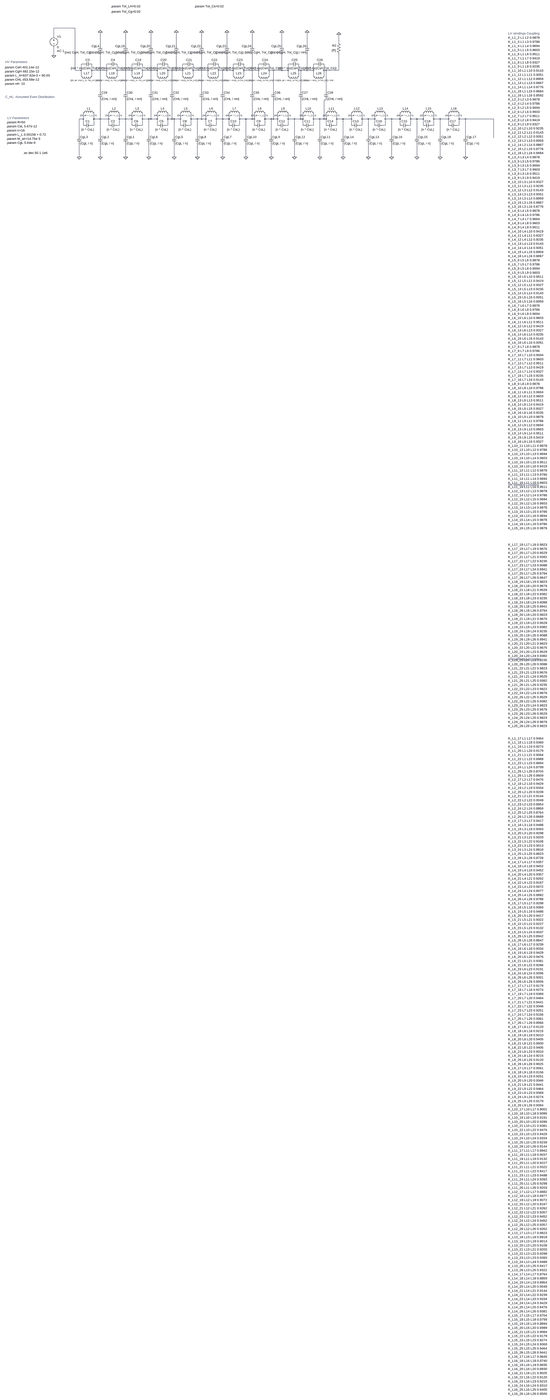
[diagram p0: schematic lumped_network_Coupling_HV.asc, whole sheet]
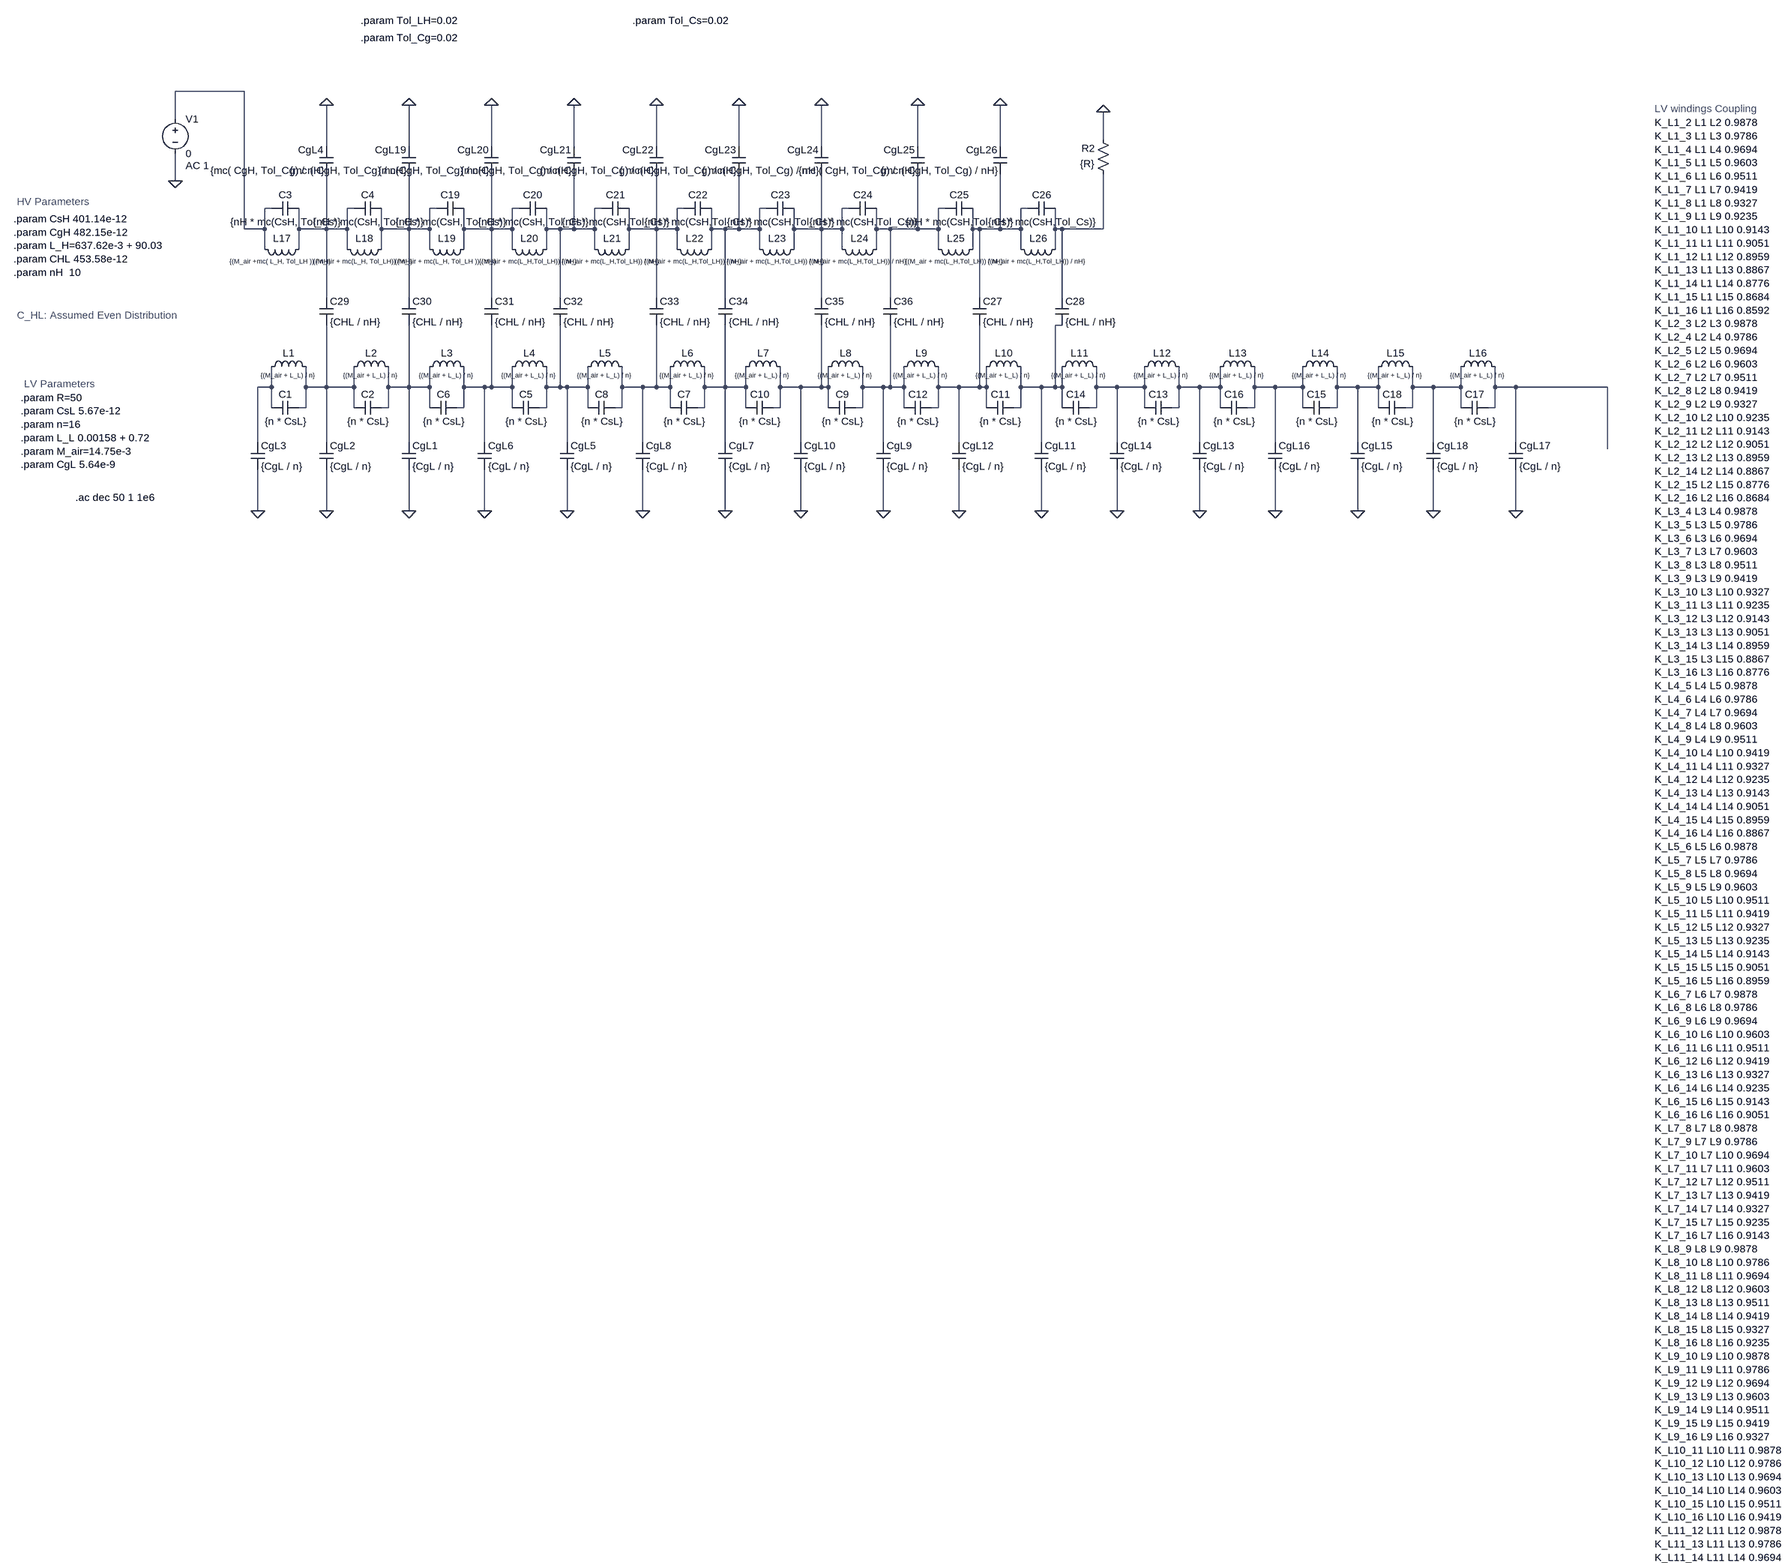
[diagram p1: schematic lumped_network_Coupling_HV.asc, part, row 1 of 3, column 1 of 1]
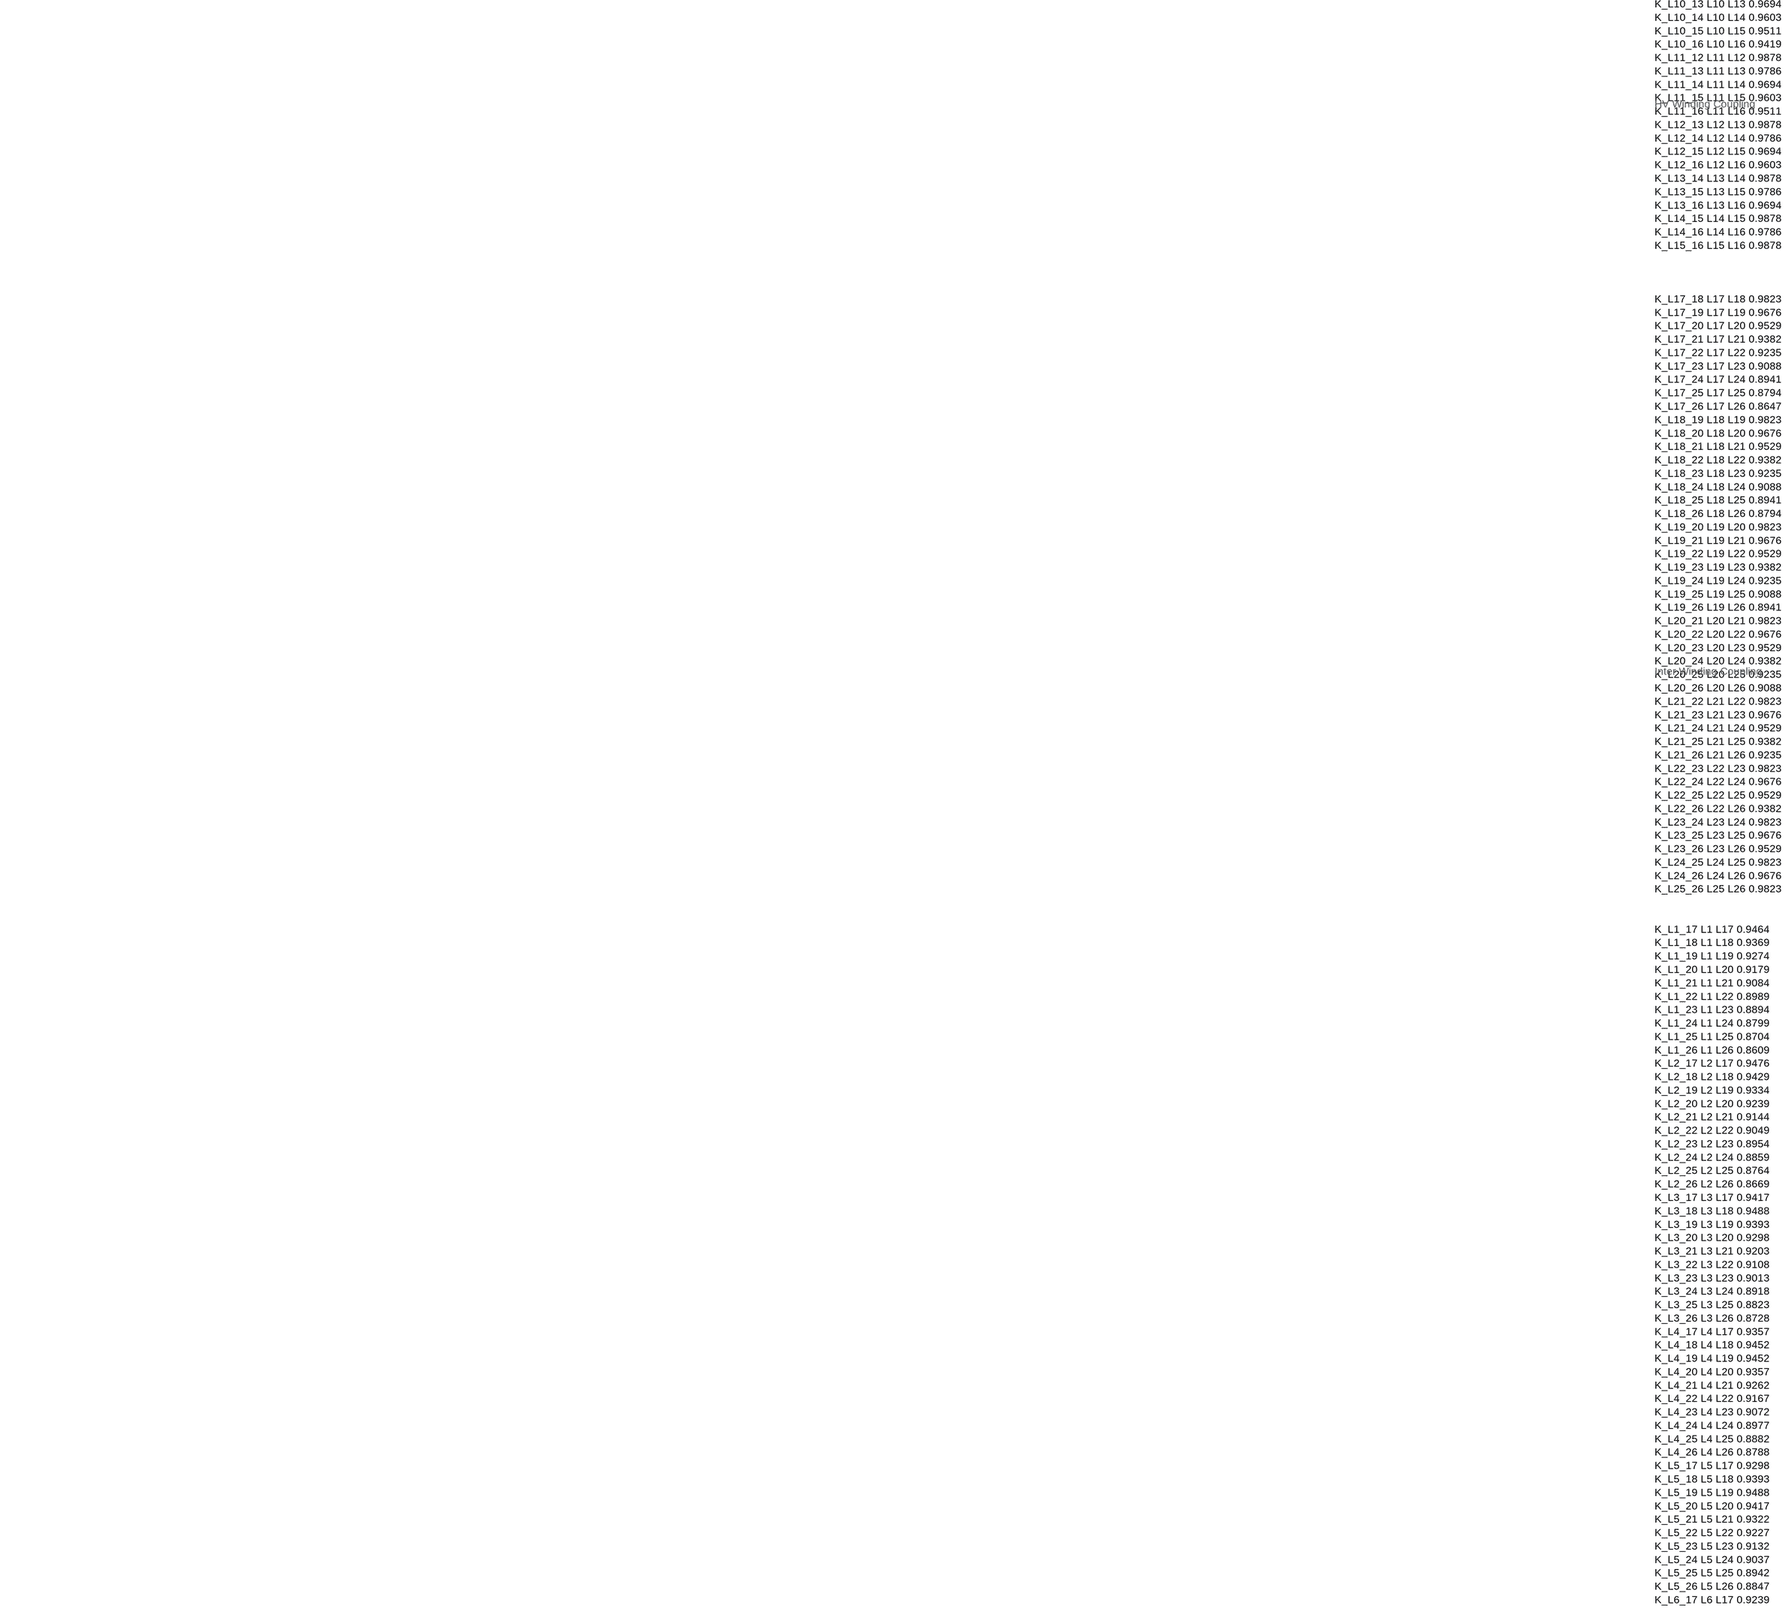
[diagram p2: schematic lumped_network_Coupling_HV.asc, part, row 2 of 3, column 1 of 1]
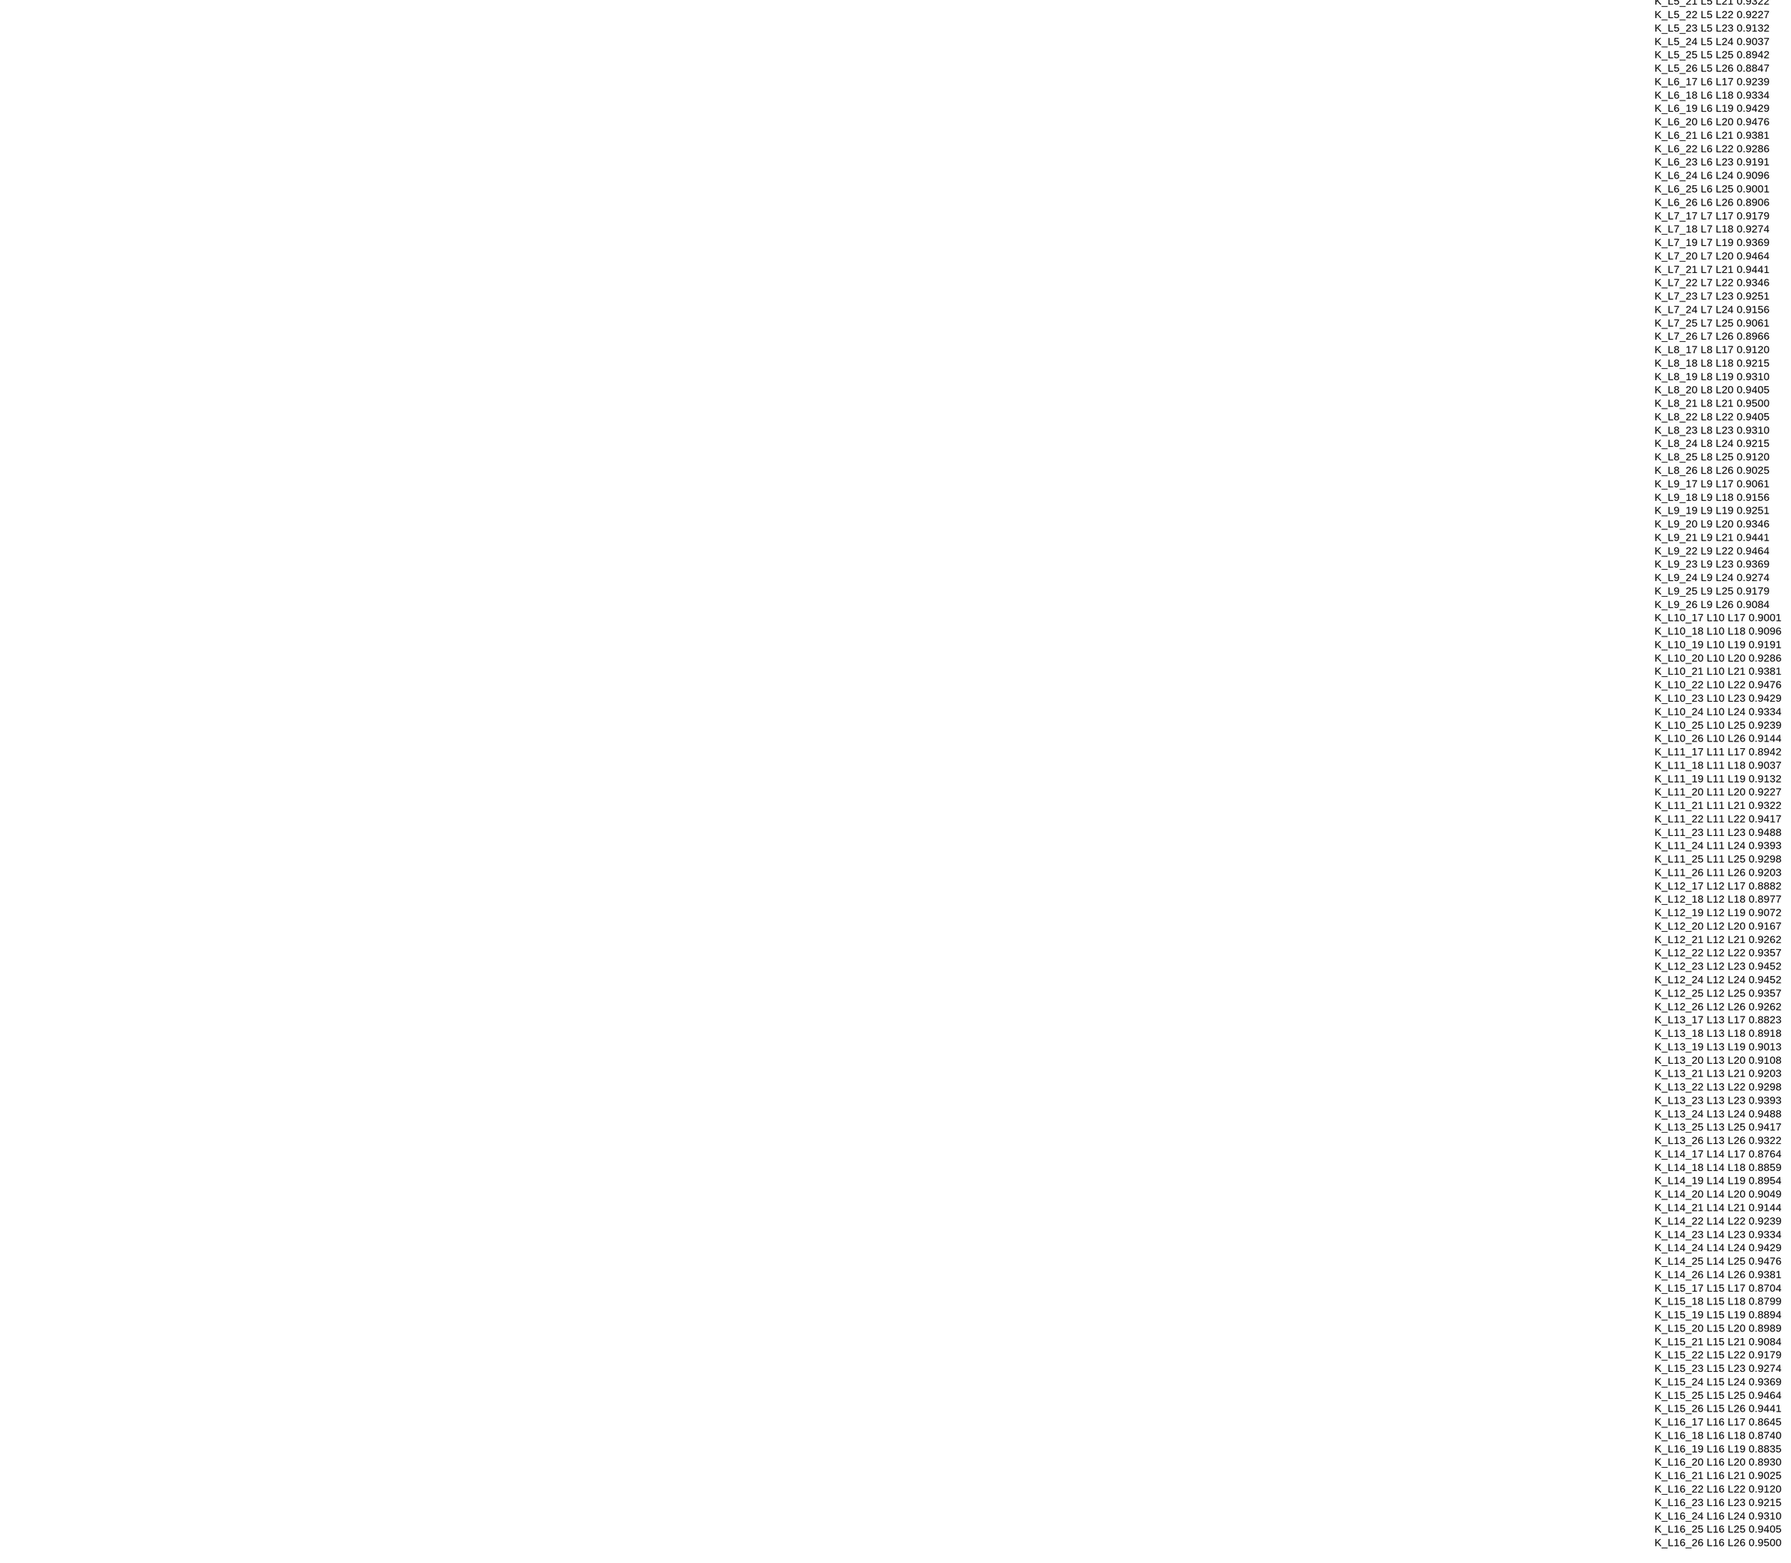
[diagram p3: schematic lumped_network_Coupling_HV.asc, part, row 3 of 3, column 1 of 1]
lumped_network_Coupling_HV.asc, the LTspice schematic file:
Version 4.1
SHEET 1 4352 8728
WIRE 432 -544 272 -544
WIRE 272 -480 272 -544
WIRE 2432 -432 2432 -496
WIRE 624 -416 624 -512
WIRE 816 -416 816 -512
WIRE 1008 -416 1008 -512
WIRE 1200 -416 1200 -512
WIRE 1392 -416 1392 -512
WIRE 1584 -416 1584 -512
WIRE 1776 -416 1776 -512
WIRE 2000 -416 2000 -512
WIRE 2192 -416 2192 -512
WIRE 272 -336 272 -400
WIRE 496 -272 480 -272
WIRE 688 -272 672 -272
WIRE 880 -272 864 -272
WIRE 1072 -272 1056 -272
WIRE 1264 -272 1248 -272
WIRE 1456 -272 1440 -272
WIRE 1648 -272 1632 -272
WIRE 1840 -272 1824 -272
WIRE 2064 -272 2048 -272
WIRE 2256 -272 2240 -272
WIRE 432 -224 432 -544
WIRE 480 -224 480 -272
WIRE 480 -224 432 -224
WIRE 560 -224 560 -272
WIRE 624 -224 624 -352
WIRE 624 -224 560 -224
WIRE 672 -224 672 -272
WIRE 672 -224 624 -224
WIRE 752 -224 752 -272
WIRE 816 -224 816 -352
WIRE 816 -224 752 -224
WIRE 864 -224 864 -272
WIRE 864 -224 816 -224
WIRE 944 -224 944 -272
WIRE 1008 -224 1008 -352
WIRE 1008 -224 944 -224
WIRE 1056 -224 1056 -272
WIRE 1056 -224 1008 -224
WIRE 1136 -224 1136 -272
WIRE 1168 -224 1136 -224
WIRE 1200 -224 1200 -352
WIRE 1200 -224 1168 -224
WIRE 1248 -224 1248 -272
WIRE 1248 -224 1200 -224
WIRE 1328 -224 1328 -272
WIRE 1392 -224 1392 -352
WIRE 1392 -224 1328 -224
WIRE 1440 -224 1440 -272
WIRE 1440 -224 1392 -224
WIRE 1520 -224 1520 -272
WIRE 1552 -224 1520 -224
WIRE 1584 -224 1584 -352
WIRE 1584 -224 1552 -224
WIRE 1632 -224 1632 -272
WIRE 1632 -224 1584 -224
WIRE 1712 -224 1712 -272
WIRE 1776 -224 1776 -352
WIRE 1776 -224 1712 -224
WIRE 1824 -224 1824 -272
WIRE 1824 -224 1776 -224
WIRE 1904 -224 1904 -272
WIRE 1936 -224 1904 -224
WIRE 2000 -224 2000 -352
WIRE 2000 -224 1936 -224
WIRE 2048 -224 2048 -272
WIRE 2048 -224 2000 -224
WIRE 2128 -224 2128 -272
WIRE 2144 -224 2128 -224
WIRE 2192 -224 2192 -352
WIRE 2192 -224 2144 -224
WIRE 2240 -224 2240 -272
WIRE 2240 -224 2192 -224
WIRE 2320 -224 2320 -272
WIRE 2336 -224 2320 -224
WIRE 2432 -224 2432 -352
WIRE 2432 -224 2336 -224
WIRE 480 -176 480 -224
WIRE 560 -176 560 -224
WIRE 672 -176 672 -224
WIRE 752 -176 752 -224
WIRE 864 -176 864 -224
WIRE 944 -176 944 -224
WIRE 1056 -176 1056 -224
WIRE 1136 -176 1136 -224
WIRE 1248 -176 1248 -224
WIRE 1328 -176 1328 -224
WIRE 1440 -176 1440 -224
WIRE 1520 -176 1520 -224
WIRE 1632 -176 1632 -224
WIRE 1712 -176 1712 -224
WIRE 1824 -176 1824 -224
WIRE 1904 -176 1904 -224
WIRE 2048 -176 2048 -224
WIRE 2128 -176 2128 -224
WIRE 2240 -176 2240 -224
WIRE 2320 -176 2320 -224
WIRE 624 -64 624 -224
WIRE 816 -64 816 -224
WIRE 1008 -64 1008 -224
WIRE 1168 -64 1168 -224
WIRE 1392 -64 1392 -224
WIRE 1552 -64 1552 -224
WIRE 1776 -64 1776 -224
WIRE 1936 -64 1936 -224
WIRE 2144 -64 2144 -224
WIRE 2336 -64 2336 -224
WIRE 2336 0 2320 0
WIRE 496 144 496 96
WIRE 496 144 464 144
WIRE 576 144 576 96
WIRE 624 144 624 0
WIRE 624 144 576 144
WIRE 688 144 688 96
WIRE 688 144 624 144
WIRE 768 144 768 96
WIRE 816 144 816 0
WIRE 816 144 768 144
WIRE 864 144 864 96
WIRE 864 144 816 144
WIRE 944 144 944 96
WIRE 992 144 944 144
WIRE 1008 144 1008 0
WIRE 1008 144 992 144
WIRE 1056 144 1056 96
WIRE 1056 144 1008 144
WIRE 1136 144 1136 96
WIRE 1168 144 1168 0
WIRE 1168 144 1136 144
WIRE 1184 144 1168 144
WIRE 1232 144 1232 96
WIRE 1232 144 1184 144
WIRE 1312 144 1312 96
WIRE 1360 144 1312 144
WIRE 1392 144 1392 0
WIRE 1392 144 1360 144
WIRE 1424 144 1424 96
WIRE 1424 144 1392 144
WIRE 1504 144 1504 96
WIRE 1552 144 1552 0
WIRE 1552 144 1504 144
WIRE 1600 144 1600 96
WIRE 1600 144 1552 144
WIRE 1680 144 1680 96
WIRE 1728 144 1680 144
WIRE 1776 144 1776 0
WIRE 1776 144 1728 144
WIRE 1792 144 1792 96
WIRE 1792 144 1776 144
WIRE 1872 144 1872 96
WIRE 1920 144 1872 144
WIRE 1936 144 1936 0
WIRE 1936 144 1920 144
WIRE 1968 144 1968 96
WIRE 1968 144 1936 144
WIRE 2048 144 2048 96
WIRE 2096 144 2048 144
WIRE 2144 144 2144 0
WIRE 2144 144 2096 144
WIRE 2160 144 2160 96
WIRE 2160 144 2144 144
WIRE 2240 144 2240 96
WIRE 2288 144 2240 144
WIRE 2320 144 2320 0
WIRE 2320 144 2288 144
WIRE 2336 144 2336 96
WIRE 2336 144 2320 144
WIRE 2416 144 2416 96
WIRE 2464 144 2416 144
WIRE 2528 144 2528 96
WIRE 2528 144 2464 144
WIRE 2608 144 2608 96
WIRE 2656 144 2608 144
WIRE 2704 144 2704 96
WIRE 2704 144 2656 144
WIRE 2784 144 2784 96
WIRE 2832 144 2784 144
WIRE 2896 144 2896 96
WIRE 2896 144 2832 144
WIRE 2976 144 2976 96
WIRE 3024 144 2976 144
WIRE 3072 144 3072 96
WIRE 3072 144 3024 144
WIRE 3152 144 3152 96
WIRE 3200 144 3152 144
WIRE 3264 144 3264 96
WIRE 3264 144 3200 144
WIRE 3344 144 3344 96
WIRE 3392 144 3344 144
WIRE 3616 144 3392 144
WIRE 496 192 496 144
WIRE 576 192 576 144
WIRE 576 192 560 192
WIRE 688 192 688 144
WIRE 768 192 768 144
WIRE 768 192 752 192
WIRE 864 192 864 144
WIRE 944 192 944 144
WIRE 944 192 928 192
WIRE 1056 192 1056 144
WIRE 1136 192 1136 144
WIRE 1136 192 1120 192
WIRE 1232 192 1232 144
WIRE 1312 192 1312 144
WIRE 1312 192 1296 192
WIRE 1424 192 1424 144
WIRE 1504 192 1504 144
WIRE 1504 192 1488 192
WIRE 1600 192 1600 144
WIRE 1680 192 1680 144
WIRE 1680 192 1664 192
WIRE 1792 192 1792 144
WIRE 1872 192 1872 144
WIRE 1872 192 1856 192
WIRE 1968 192 1968 144
WIRE 2048 192 2048 144
WIRE 2048 192 2032 192
WIRE 2160 192 2160 144
WIRE 2240 192 2240 144
WIRE 2240 192 2224 192
WIRE 2336 192 2336 144
WIRE 2416 192 2416 144
WIRE 2416 192 2400 192
WIRE 2528 192 2528 144
WIRE 2608 192 2608 144
WIRE 2608 192 2592 192
WIRE 2704 192 2704 144
WIRE 2784 192 2784 144
WIRE 2784 192 2768 192
WIRE 2896 192 2896 144
WIRE 2976 192 2976 144
WIRE 2976 192 2960 192
WIRE 3072 192 3072 144
WIRE 3152 192 3152 144
WIRE 3152 192 3136 192
WIRE 3264 192 3264 144
WIRE 3344 192 3344 144
WIRE 3344 192 3328 192
WIRE 464 272 464 144
WIRE 624 272 624 144
WIRE 816 272 816 144
WIRE 992 272 992 144
WIRE 1184 272 1184 144
WIRE 1360 272 1360 144
WIRE 1552 272 1552 144
WIRE 1728 272 1728 144
WIRE 1920 272 1920 144
WIRE 2096 272 2096 144
WIRE 2288 272 2288 144
WIRE 2464 272 2464 144
WIRE 2656 272 2656 144
WIRE 2832 272 2832 144
WIRE 3024 272 3024 144
WIRE 3200 272 3200 144
WIRE 3392 272 3392 144
WIRE 3616 288 3616 144
WIRE 464 432 464 336
WIRE 624 432 624 336
WIRE 816 432 816 336
WIRE 992 432 992 336
WIRE 1184 432 1184 336
WIRE 1360 432 1360 336
WIRE 1552 432 1552 336
WIRE 1728 432 1728 336
WIRE 1920 432 1920 336
WIRE 2096 432 2096 336
WIRE 2288 432 2288 336
WIRE 2464 432 2464 336
WIRE 2656 432 2656 336
WIRE 2832 432 2832 336
WIRE 3024 432 3024 336
WIRE 3200 432 3200 336
WIRE 3392 432 3392 336
FLAG 816 432 0
FLAG 272 -336 0
FLAG 624 432 0
FLAG 1184 432 0
FLAG 992 432 0
FLAG 1552 432 0
FLAG 1360 432 0
FLAG 1920 432 0
FLAG 1728 432 0
FLAG 2288 432 0
FLAG 2096 432 0
FLAG 2656 432 0
FLAG 2464 432 0
FLAG 3024 432 0
FLAG 2832 432 0
FLAG 3392 432 0
FLAG 3200 432 0
FLAG 2432 -496 0
FLAG 624 -512 0
FLAG 816 -512 0
FLAG 1008 -512 0
FLAG 1200 -512 0
FLAG 1392 -512 0
FLAG 1584 -512 0
FLAG 1776 -512 0
FLAG 2000 -512 0
FLAG 2192 -512 0
FLAG 464 432 0
DATAFLAG 560 -256 ""
SYMBOL voltage 272 -496 R0
WINDOW 123 24 124 Left 2
WINDOW 39 0 0 Left 0
SYMATTR Value2 AC 1
SYMATTR InstName V1
SYMATTR Value 0
SYMBOL cap 752 176 R90
WINDOW 0 0 32 VBottom 2
WINDOW 3 32 32 VTop 2
SYMATTR InstName C2
SYMATTR Value {n * CsL}
SYMBOL ind 672 112 R270
WINDOW 0 32 56 VTop 2
WINDOW 3 -14 56 VTop 1
SYMATTR InstName L2
SYMATTR Value {(M_air + L_L) / n}
SYMATTR Type ind
SYMBOL cap 800 272 R0
SYMATTR InstName CgL1
SYMATTR Value {CgL / n}
SYMBOL cap 560 176 R90
WINDOW 0 0 32 VBottom 2
WINDOW 3 32 32 VTop 2
SYMATTR InstName C1
SYMATTR Value {n * CsL}
SYMBOL ind 480 112 R270
WINDOW 0 32 56 VTop 2
WINDOW 3 -14 56 VTop 1
SYMATTR InstName L1
SYMATTR Value {(M_air + L_L) / n}
SYMATTR Type ind
SYMBOL cap 608 272 R0
SYMATTR InstName CgL2
SYMATTR Value {CgL / n}
SYMBOL cap 1120 176 R90
WINDOW 0 0 32 VBottom 2
WINDOW 3 32 32 VTop 2
SYMATTR InstName C5
SYMATTR Value {n * CsL}
SYMBOL ind 1040 112 R270
WINDOW 0 32 56 VTop 2
WINDOW 3 -14 56 VTop 1
SYMATTR InstName L4
SYMATTR Value {(M_air + L_L) / n}
SYMATTR Type ind
SYMBOL cap 1168 272 R0
SYMATTR InstName CgL5
SYMATTR Value {CgL / n}
SYMBOL cap 928 176 R90
WINDOW 0 0 32 VBottom 2
WINDOW 3 32 32 VTop 2
SYMATTR InstName C6
SYMATTR Value {n * CsL}
SYMBOL ind 848 112 R270
WINDOW 0 32 56 VTop 2
WINDOW 3 -14 56 VTop 1
SYMATTR InstName L3
SYMATTR Value {(M_air + L_L) / n}
SYMATTR Type ind
SYMBOL cap 976 272 R0
SYMATTR InstName CgL6
SYMATTR Value {CgL / n}
SYMBOL cap 1488 176 R90
WINDOW 0 0 32 VBottom 2
WINDOW 3 32 32 VTop 2
SYMATTR InstName C7
SYMATTR Value {n * CsL}
SYMBOL ind 1408 112 R270
WINDOW 0 32 56 VTop 2
WINDOW 3 -14 56 VTop 1
SYMATTR InstName L6
SYMATTR Value {(M_air + L_L) / n}
SYMATTR Type ind
SYMBOL cap 1536 272 R0
SYMATTR InstName CgL7
SYMATTR Value {CgL / n}
SYMBOL cap 1296 176 R90
WINDOW 0 0 32 VBottom 2
WINDOW 3 32 32 VTop 2
SYMATTR InstName C8
SYMATTR Value {n * CsL}
SYMBOL ind 1216 112 R270
WINDOW 0 32 56 VTop 2
WINDOW 3 -14 56 VTop 1
SYMATTR InstName L5
SYMATTR Value {(M_air + L_L) / n}
SYMATTR Type ind
SYMBOL cap 1344 272 R0
SYMATTR InstName CgL8
SYMATTR Value {CgL / n}
SYMBOL cap 1856 176 R90
WINDOW 0 0 32 VBottom 2
WINDOW 3 32 32 VTop 2
SYMATTR InstName C9
SYMATTR Value {n * CsL}
SYMBOL ind 1776 112 R270
WINDOW 0 32 56 VTop 2
WINDOW 3 -14 56 VTop 1
SYMATTR InstName L8
SYMATTR Value {(M_air + L_L) / n}
SYMATTR Type ind
SYMBOL cap 1904 272 R0
SYMATTR InstName CgL9
SYMATTR Value {CgL / n}
SYMBOL cap 1664 176 R90
WINDOW 0 0 32 VBottom 2
WINDOW 3 32 32 VTop 2
SYMATTR InstName C10
SYMATTR Value {n * CsL}
SYMBOL ind 1584 112 R270
WINDOW 0 32 56 VTop 2
WINDOW 3 -14 56 VTop 1
SYMATTR InstName L7
SYMATTR Value {(M_air + L_L) / n}
SYMATTR Type ind
SYMBOL cap 1712 272 R0
SYMATTR InstName CgL10
SYMATTR Value {CgL / n}
SYMBOL cap 2224 176 R90
WINDOW 0 0 32 VBottom 2
WINDOW 3 32 32 VTop 2
SYMATTR InstName C11
SYMATTR Value {n * CsL}
SYMBOL ind 2144 112 R270
WINDOW 0 32 56 VTop 2
WINDOW 3 -14 56 VTop 1
SYMATTR InstName L10
SYMATTR Value {(M_air + L_L) / n}
SYMATTR Type ind
SYMBOL cap 2272 272 R0
SYMATTR InstName CgL11
SYMATTR Value {CgL / n}
SYMBOL cap 2032 176 R90
WINDOW 0 0 32 VBottom 2
WINDOW 3 32 32 VTop 2
SYMATTR InstName C12
SYMATTR Value {n * CsL}
SYMBOL ind 1952 112 R270
WINDOW 0 32 56 VTop 2
WINDOW 3 -14 56 VTop 1
SYMATTR InstName L9
SYMATTR Value {(M_air + L_L) / n}
SYMATTR Type ind
SYMBOL cap 2080 272 R0
SYMATTR InstName CgL12
SYMATTR Value {CgL / n}
SYMBOL cap 2592 176 R90
WINDOW 0 0 32 VBottom 2
WINDOW 3 32 32 VTop 2
SYMATTR InstName C13
SYMATTR Value {n * CsL}
SYMBOL ind 2512 112 R270
WINDOW 0 32 56 VTop 2
WINDOW 3 -14 56 VTop 1
SYMATTR InstName L12
SYMATTR Value {(M_air + L_L) / n}
SYMATTR Type ind
SYMBOL cap 2640 272 R0
SYMATTR InstName CgL13
SYMATTR Value {CgL / n}
SYMBOL cap 2400 176 R90
WINDOW 0 0 32 VBottom 2
WINDOW 3 32 32 VTop 2
SYMATTR InstName C14
SYMATTR Value {n * CsL}
SYMBOL ind 2320 112 R270
WINDOW 0 32 56 VTop 2
WINDOW 3 -14 56 VTop 1
SYMATTR InstName L11
SYMATTR Value {(M_air + L_L) / n}
SYMATTR Type ind
SYMBOL cap 2448 272 R0
SYMATTR InstName CgL14
SYMATTR Value {CgL / n}
SYMBOL cap 2960 176 R90
WINDOW 0 0 32 VBottom 2
WINDOW 3 32 32 VTop 2
SYMATTR InstName C15
SYMATTR Value {n * CsL}
SYMBOL ind 2880 112 R270
WINDOW 0 32 56 VTop 2
WINDOW 3 -14 56 VTop 1
SYMATTR InstName L14
SYMATTR Value {(M_air + L_L) / n}
SYMATTR Type ind
SYMBOL cap 3008 272 R0
SYMATTR InstName CgL15
SYMATTR Value {CgL / n}
SYMBOL cap 2768 176 R90
WINDOW 0 0 32 VBottom 2
WINDOW 3 32 32 VTop 2
SYMATTR InstName C16
SYMATTR Value {n * CsL}
SYMBOL ind 2688 112 R270
WINDOW 0 32 56 VTop 2
WINDOW 3 -14 56 VTop 1
SYMATTR InstName L13
SYMATTR Value {(M_air + L_L) / n}
SYMATTR Type ind
SYMBOL cap 2816 272 R0
SYMATTR InstName CgL16
SYMATTR Value {CgL / n}
SYMBOL cap 3328 176 R90
WINDOW 0 0 32 VBottom 2
WINDOW 3 32 32 VTop 2
SYMATTR InstName C17
SYMATTR Value {n * CsL}
SYMBOL ind 3248 112 R270
WINDOW 0 32 56 VTop 2
WINDOW 3 -14 56 VTop 1
SYMATTR InstName L16
SYMATTR Value {(M_air + L_L) / n}
SYMATTR Type ind
SYMBOL cap 3376 272 R0
SYMATTR InstName CgL17
SYMATTR Value {CgL / n}
SYMBOL cap 3136 176 R90
WINDOW 0 0 32 VBottom 2
WINDOW 3 32 32 VTop 2
SYMATTR InstName C18
SYMATTR Value {n * CsL}
SYMBOL ind 3056 112 R270
WINDOW 0 32 56 VTop 2
WINDOW 3 -14 56 VTop 1
SYMATTR InstName L15
SYMATTR Value {(M_air + L_L) / n}
SYMATTR Type ind
SYMBOL cap 3184 272 R0
SYMATTR InstName CgL18
SYMATTR Value {CgL / n}
SYMBOL cap 608 -64 R0
SYMATTR InstName C29
SYMATTR Value {CHL / nH}
SYMBOL cap 800 -64 R0
SYMATTR InstName C30
SYMATTR Value {CHL / nH}
SYMBOL cap 2128 -64 R0
SYMATTR InstName C27
SYMATTR Value {CHL / nH}
SYMBOL cap 2320 -64 R0
SYMATTR InstName C28
SYMATTR Value {CHL / nH}
SYMBOL cap 992 -64 R0
SYMATTR InstName C31
SYMATTR Value {CHL / nH}
SYMBOL cap 1152 -64 R0
SYMATTR InstName C32
SYMATTR Value {CHL / nH}
SYMBOL cap 1376 -64 R0
SYMATTR InstName C33
SYMATTR Value {CHL / nH}
SYMBOL cap 1536 -64 R0
SYMATTR InstName C34
SYMATTR Value {CHL / nH}
SYMBOL cap 1760 -64 R0
SYMATTR InstName C35
SYMATTR Value {CHL / nH}
SYMBOL cap 1920 -64 R0
SYMATTR InstName C36
SYMATTR Value {CHL / nH}
SYMBOL res 2448 -336 R180
WINDOW 0 36 76 Left 2
WINDOW 3 36 40 Left 2
SYMATTR InstName R2
SYMATTR Value {R}
SYMBOL cap 496 -256 R270
WINDOW 0 32 32 VTop 2
WINDOW 3 0 32 VBottom 2
SYMATTR InstName C3
SYMATTR Value {nH * mc(CsH, Tol_Cs)}
SYMBOL ind 576 -192 R90
WINDOW 0 5 56 VBottom 2
WINDOW 3 32 56 VTop 1
SYMATTR InstName L17
SYMATTR Value {(M_air +mc( L_H, Tol_LH )) / nH}
SYMATTR Type ind
SYMBOL cap 688 -256 R270
WINDOW 0 32 32 VTop 2
WINDOW 3 0 32 VBottom 2
SYMATTR InstName C4
SYMATTR Value {nH * mc(CsH, Tol_Cs)}
SYMBOL ind 768 -192 R90
WINDOW 0 5 56 VBottom 2
WINDOW 3 32 56 VTop 1
SYMATTR InstName L18
SYMATTR Value {(M_air + mc(L_H, Tol_LH)) / nH}
SYMATTR Type ind
SYMBOL cap 640 -352 R180
WINDOW 0 24 56 Left 2
WINDOW 3 24 8 Left 2
SYMATTR InstName CgL4
SYMATTR Value {mc( CgH, Tol_Cg) / nH}
SYMBOL cap 880 -256 R270
WINDOW 0 32 32 VTop 2
WINDOW 3 0 32 VBottom 2
SYMATTR InstName C19
SYMATTR Value {nH * mc(CsH, Tol_Cs)}
SYMBOL ind 960 -192 R90
WINDOW 0 5 56 VBottom 2
WINDOW 3 32 56 VTop 1
SYMATTR InstName L19
SYMATTR Value {(M_air + mc(L_H, Tol_LH )) / nH}
SYMATTR Type ind
SYMBOL cap 832 -352 R180
WINDOW 0 24 56 Left 2
WINDOW 3 24 8 Left 2
SYMATTR InstName CgL19
SYMATTR Value {mc ( CgH, Tol_Cg) / nH}
SYMBOL cap 1072 -256 R270
WINDOW 0 32 32 VTop 2
WINDOW 3 0 32 VBottom 2
SYMATTR InstName C20
SYMATTR Value {nH * mc(CsH, Tol_Cs)}
SYMBOL ind 1152 -192 R90
WINDOW 0 5 56 VBottom 2
WINDOW 3 32 56 VTop 1
SYMATTR InstName L20
SYMATTR Value {(M_air + mc(L_H,Tol_LH)) / nH}
SYMATTR Type ind
SYMBOL cap 1024 -352 R180
WINDOW 0 24 56 Left 2
WINDOW 3 24 8 Left 2
SYMATTR InstName CgL20
SYMATTR Value {mc(CgH, Tol_Cg) / nH}
SYMBOL cap 1264 -256 R270
WINDOW 0 32 32 VTop 2
WINDOW 3 0 32 VBottom 2
SYMATTR InstName C21
SYMATTR Value {nH * mc(CsH,Tol_Cs)}
SYMBOL ind 1344 -192 R90
WINDOW 0 5 56 VBottom 2
WINDOW 3 32 56 VTop 1
SYMATTR InstName L21
SYMATTR Value {(M_air + mc(L_H,Tol_LH)) / nH}
SYMATTR Type ind
SYMBOL cap 1216 -352 R180
WINDOW 0 24 56 Left 2
WINDOW 3 24 8 Left 2
SYMATTR InstName CgL21
SYMATTR Value {mc(CgH, Tol_Cg) / nH}
SYMBOL cap 1456 -256 R270
WINDOW 0 32 32 VTop 2
WINDOW 3 0 32 VBottom 2
SYMATTR InstName C22
SYMATTR Value {nH * mc(CsH,Tol_Cs)}
SYMBOL ind 1536 -192 R90
WINDOW 0 5 56 VBottom 2
WINDOW 3 32 56 VTop 1
SYMATTR InstName L22
SYMATTR Value {(M_air + mc(L_H,Tol_LH)) / nH}
SYMATTR Type ind
SYMBOL cap 1408 -352 R180
WINDOW 0 24 56 Left 2
WINDOW 3 24 8 Left 2
SYMATTR InstName CgL22
SYMATTR Value {mc( CgH, Tol_Cg) / nH}
SYMBOL cap 1648 -256 R270
WINDOW 0 32 32 VTop 2
WINDOW 3 0 32 VBottom 2
SYMATTR InstName C23
SYMATTR Value {nH * mc(CsH,Tol_Cs)}
SYMBOL ind 1728 -192 R90
WINDOW 0 5 56 VBottom 2
WINDOW 3 32 56 VTop 1
SYMATTR InstName L23
SYMATTR Value {(M_air + mc(L_H,Tol_LH)) / nH}
SYMATTR Type ind
SYMBOL cap 1600 -352 R180
WINDOW 0 24 56 Left 2
WINDOW 3 24 8 Left 2
SYMATTR InstName CgL23
SYMATTR Value { mc( CgH, Tol_Cg) / nH}
SYMBOL cap 1840 -256 R270
WINDOW 0 32 32 VTop 2
WINDOW 3 0 32 VBottom 2
SYMATTR InstName C24
SYMATTR Value {nH * mc(CsH,Tol_Cs)}
SYMBOL ind 1920 -192 R90
WINDOW 0 5 56 VBottom 2
WINDOW 3 32 56 VTop 1
SYMATTR InstName L24
SYMATTR Value {(M_air + mc(L_H,Tol_LH)) / nH}
SYMATTR Type ind
SYMBOL cap 1792 -352 R180
WINDOW 0 24 56 Left 2
WINDOW 3 24 8 Left 2
SYMATTR InstName CgL24
SYMATTR Value { mc( CgH, Tol_Cg) / nH}
SYMBOL cap 2064 -256 R270
WINDOW 0 32 32 VTop 2
WINDOW 3 0 32 VBottom 2
SYMATTR InstName C25
SYMATTR Value {nH * mc(CsH,Tol_Cs)}
SYMBOL ind 2144 -192 R90
WINDOW 0 5 56 VBottom 2
WINDOW 3 32 56 VTop 1
SYMATTR InstName L25
SYMATTR Value {(M_air + mc(L_H,Tol_LH)) / nH}
SYMATTR Type ind
SYMBOL cap 2016 -352 R180
WINDOW 0 24 56 Left 2
WINDOW 3 24 8 Left 2
SYMATTR InstName CgL25
SYMATTR Value {mc ( CgH, Tol_Cg) / nH}
SYMBOL cap 2256 -256 R270
WINDOW 0 32 32 VTop 2
WINDOW 3 0 32 VBottom 2
SYMATTR InstName C26
SYMATTR Value {nH * mc(CsH,Tol_Cs)}
SYMBOL ind 2336 -192 R90
WINDOW 0 5 56 VBottom 2
WINDOW 3 32 56 VTop 1
SYMATTR InstName L26
SYMATTR Value {(M_air + mc(L_H,Tol_LH)) / nH}
SYMATTR Type ind
SYMBOL cap 2208 -352 R180
WINDOW 0 24 56 Left 2
WINDOW 3 24 8 Left 2
SYMATTR InstName CgL26
SYMATTR Value {mc ( CgH, Tol_Cg) / nH}
SYMBOL cap 448 272 R0
SYMATTR InstName CgL3
SYMATTR Value {CgL / n}
TEXT 40 400 Left 2 !.ac dec 50 1 1e6
TEXT -88 168 Left 2 !.param R=50\n.param CsL 5.67e-12\n.param n=16\n.param L_L 0.00158 + 0.72\n.param M_air=14.75e-3\n.param CgL 5.64e-9
TEXT -104 -248 Left 2 !.param CsH 401.14e-12\n.param CgH 482.15e-12\n.param L_H=637.62e-3 + 90.03\n.param CHL 453.58e-12\n.param nH  10
TEXT -96 -288 Left 2 ;HV Parameters
TEXT -96 -24 Left 2 ;C_HL: Assumed Even Distribution
TEXT -80 136 Left 2 ;LV Parameters
TEXT 704 -1088 Left 2 !.param Tol_Cg=0.02
TEXT 704 -1128 Left 2 !.param Tol_LH=0.02
TEXT 1336 -1128 Left 2 !.param Tol_Cs=0.02
TEXT 3968 -472 Left 2 !K_L1_2 L1 L2 0.9878\nK_L1_3 L1 L3 0.9786\nK_L1_4 L1 L4 0.9694\nK_L1_5 L1 L5 0.9603\nK_L1_6 L1 L6 0.9511\nK_L1_7 L1 L7 0.9419\nK_L1_8 L1 L8 0.9327\nK_L1_9 L1 L9 0.9235\nK_L1_10 L1 L10 0.9143\nK_L1_11 L1 L11 0.9051\nK_L1_12 L1 L12 0.8959\nK_L1_13 L1 L13 0.8867\nK_L1_14 L1 L14 0.8776\nK_L1_15 L1 L15 0.8684\nK_L1_16 L1 L16 0.8592\nK_L2_3 L2 L3 0.9878\nK_L2_4 L2 L4 0.9786\nK_L2_5 L2 L5 0.9694\nK_L2_6 L2 L6 0.9603\nK_L2_7 L2 L7 0.9511\nK_L2_8 L2 L8 0.9419\nK_L2_9 L2 L9 0.9327\nK_L2_10 L2 L10 0.9235\nK_L2_11 L2 L11 0.9143\nK_L2_12 L2 L12 0.9051\nK_L2_13 L2 L13 0.8959\nK_L2_14 L2 L14 0.8867\nK_L2_15 L2 L15 0.8776\nK_L2_16 L2 L16 0.8684\nK_L3_4 L3 L4 0.9878\nK_L3_5 L3 L5 0.9786\nK_L3_6 L3 L6 0.9694\nK_L3_7 L3 L7 0.9603\nK_L3_8 L3 L8 0.9511\nK_L3_9 L3 L9 0.9419\nK_L3_10 L3 L10 0.9327\nK_L3_11 L3 L11 0.9235\nK_L3_12 L3 L12 0.9143\nK_L3_13 L3 L13 0.9051\nK_L3_14 L3 L14 0.8959\nK_L3_15 L3 L15 0.8867\nK_L3_16 L3 L16 0.8776\nK_L4_5 L4 L5 0.9878\nK_L4_6 L4 L6 0.9786\nK_L4_7 L4 L7 0.9694\nK_L4_8 L4 L8 0.9603\nK_L4_9 L4 L9 0.9511\nK_L4_10 L4 L10 0.9419\nK_L4_11 L4 L11 0.9327\nK_L4_12 L4 L12 0.9235\nK_L4_13 L4 L13 0.9143\nK_L4_14 L4 L14 0.9051\nK_L4_15 L4 L15 0.8959\nK_L4_16 L4 L16 0.8867\nK_L5_6 L5 L6 0.9878\nK_L5_7 L5 L7 0.9786\nK_L5_8 L5 L8 0.9694\nK_L5_9 L5 L9 0.9603\nK_L5_10 L5 L10 0.9511\nK_L5_11 L5 L11 0.9419\nK_L5_12 L5 L12 0.9327\nK_L5_13 L5 L13 0.9235\nK_L5_14 L5 L14 0.9143\nK_L5_15 L5 L15 0.9051\nK_L5_16 L5 L16 0.8959\nK_L6_7 L6 L7 0.9878\nK_L6_8 L6 L8 0.9786\nK_L6_9 L6 L9 0.9694\nK_L6_10 L6 L10 0.9603\nK_L6_11 L6 L11 0.9511\nK_L6_12 L6 L12 0.9419\nK_L6_13 L6 L13 0.9327\nK_L6_14 L6 L14 0.9235\nK_L6_15 L6 L15 0.9143\nK_L6_16 L6 L16 0.9051\nK_L7_8 L7 L8 0.9878\nK_L7_9 L7 L9 0.9786\nK_L7_10 L7 L10 0.9694\nK_L7_11 L7 L11 0.9603\nK_L7_12 L7 L12 0.9511\nK_L7_13 L7 L13 0.9419\nK_L7_14 L7 L14 0.9327\nK_L7_15 L7 L15 0.9235\nK_L7_16 L7 L16 0.9143\nK_L8_9 L8 L9 0.9878\nK_L8_10 L8 L10 0.9786\nK_L8_11 L8 L11 0.9694\nK_L8_12 L8 L12 0.9603\nK_L8_13 L8 L13 0.9511\nK_L8_14 L8 L14 0.9419\nK_L8_15 L8 L15 0.9327\nK_L8_16 L8 L16 0.9235\nK_L9_10 L9 L10 0.9878\nK_L9_11 L9 L11 0.9786\nK_L9_12 L9 L12 0.9694\nK_L9_13 L9 L13 0.9603\nK_L9_14 L9 L14 0.9511\nK_L9_15 L9 L15 0.9419\nK_L9_16 L9 L16 0.9327\nK_L10_11 L10 L11 0.9878\nK_L10_12 L10 L12 0.9786\nK_L10_13 L10 L13 0.9694\nK_L10_14 L10 L14 0.9603\nK_L10_15 L10 L15 0.9511\nK_L10_16 L10 L16 0.9419\nK_L11_12 L11 L12 0.9878\nK_L11_13 L11 L13 0.9786\nK_L11_14 L11 L14 0.9694\nK_L11_15 L11 L15 0.9603\nK_L11_16 L11 L16 0.9511\nK_L12_13 L12 L13 0.9878\nK_L12_14 L12 L14 0.9786\nK_L12_15 L12 L15 0.9694\nK_L12_16 L12 L16 0.9603\nK_L13_14 L13 L14 0.9878\nK_L13_15 L13 L15 0.9786\nK_L13_16 L13 L16 0.9694\nK_L14_15 L14 L15 0.9878\nK_L14_16 L14 L16 0.9786\nK_L15_16 L15 L16 0.9878\n \n \n\nK_L17_18 L17 L18 0.9823\nK_L17_19 L17 L19 0.9676\nK_L17_20 L17 L20 0.9529\nK_L17_21 L17 L21 0.9382\nK_L17_22 L17 L22 0.9235\nK_L17_23 L17 L23 0.9088\nK_L17_24 L17 L24 0.8941\nK_L17_25 L17 L25 0.8794\nK_L17_26 L17 L26 0.8647\nK_L18_19 L18 L19 0.9823\nK_L18_20 L18 L20 0.9676\nK_L18_21 L18 L21 0.9529\nK_L18_22 L18 L22 0.9382\nK_L18_23 L18 L23 0.9235\nK_L18_24 L18 L24 0.9088\nK_L18_25 L18 L25 0.8941\nK_L18_26 L18 L26 0.8794\nK_L19_20 L19 L20 0.9823\nK_L19_21 L19 L21 0.9676\nK_L19_22 L19 L22 0.9529\nK_L19_23 L19 L23 0.9382\nK_L19_24 L19 L24 0.9235\nK_L19_25 L19 L25 0.9088\nK_L19_26 L19 L26 0.8941\nK_L20_21 L20 L21 0.9823\nK_L20_22 L20 L22 0.9676\nK_L20_23 L20 L23 0.9529\nK_L20_24 L20 L24 0.9382\nK_L20_25 L20 L25 0.9235\nK_L20_26 L20 L26 0.9088\nK_L21_22 L21 L22 0.9823\nK_L21_23 L21 L23 0.9676\nK_L21_24 L21 L24 0.9529\nK_L21_25 L21 L25 0.9382\nK_L21_26 L21 L26 0.9235\nK_L22_23 L22 L23 0.9823\nK_L22_24 L22 L24 0.9676\nK_L22_25 L22 L25 0.9529\nK_L22_26 L22 L26 0.9382\nK_L23_24 L23 L24 0.9823\nK_L23_25 L23 L25 0.9676\nK_L23_26 L23 L26 0.9529\nK_L24_25 L24 L25 0.9823\nK_L24_26 L24 L26 0.9676\nK_L25_26 L25 L26 0.9823\n \n \nK_L1_17 L1 L17 0.9464\nK_L1_18 L1 L18 0.9369\nK_L1_19 L1 L19 0.9274\nK_L1_20 L1 L20 0.9179\nK_L1_21 L1 L21 0.9084\nK_L1_22 L1 L22 0.8989\nK_L1_23 L1 L23 0.8894\nK_L1_24 L1 L24 0.8799\nK_L1_25 L1 L25 0.8704\nK_L1_26 L1 L26 0.8609\nK_L2_17 L2 L17 0.9476\nK_L2_18 L2 L18 0.9429\nK_L2_19 L2 L19 0.9334\nK_L2_20 L2 L20 0.9239\nK_L2_21 L2 L21 0.9144\nK_L2_22 L2 L22 0.9049\nK_L2_23 L2 L23 0.8954\nK_L2_24 L2 L24 0.8859\nK_L2_25 L2 L25 0.8764\nK_L2_26 L2 L26 0.8669\nK_L3_17 L3 L17 0.9417\nK_L3_18 L3 L18 0.9488\nK_L3_19 L3 L19 0.9393\nK_L3_20 L3 L20 0.9298\nK_L3_21 L3 L21 0.9203\nK_L3_22 L3 L22 0.9108\nK_L3_23 L3 L23 0.9013\nK_L3_24 L3 L24 0.8918\nK_L3_25 L3 L25 0.8823\nK_L3_26 L3 L26 0.8728\nK_L4_17 L4 L17 0.9357\nK_L4_18 L4 L18 0.9452\nK_L4_19 L4 L19 0.9452\nK_L4_20 L4 L20 0.9357\nK_L4_21 L4 L21 0.9262\nK_L4_22 L4 L22 0.9167\nK_L4_23 L4 L23 0.9072\nK_L4_24 L4 L24 0.8977\nK_L4_25 L4 L25 0.8882\nK_L4_26 L4 L26 0.8788\nK_L5_17 L5 L17 0.9298\nK_L5_18 L5 L18 0.9393\nK_L5_19 L5 L19 0.9488\nK_L5_20 L5 L20 0.9417\nK_L5_21 L5 L21 0.9322\nK_L5_22 L5 L22 0.9227\nK_L5_23 L5 L23 0.9132\nK_L5_24 L5 L24 0.9037\nK_L5_25 L5 L25 0.8942\nK_L5_26 L5 L26 0.8847\nK_L6_17 L6 L17 0.9239\nK_L6_18 L6 L18 0.9334\nK_L6_19 L6 L19 0.9429\nK_L6_20 L6 L20 0.9476\nK_L6_21 L6 L21 0.9381\nK_L6_22 L6 L22 0.9286\nK_L6_23 L6 L23 0.9191\nK_L6_24 L6 L24 0.9096\nK_L6_25 L6 L25 0.9001\nK_L6_26 L6 L26 0.8906\nK_L7_17 L7 L17 0.9179\nK_L7_18 L7 L18 0.9274\nK_L7_19 L7 L19 0.9369\nK_L7_20 L7 L20 0.9464\nK_L7_21 L7 L21 0.9441\nK_L7_22 L7 L22 0.9346\nK_L7_23 L7 L23 0.9251\nK_L7_24 L7 L24 0.9156\nK_L7_25 L7 L25 0.9061\nK_L7_26 L7 L26 0.8966\nK_L8_17 L8 L17 0.9120\nK_L8_18 L8 L18 0.9215\nK_L8_19 L8 L19 0.9310\nK_L8_20 L8 L20 0.9405\nK_L8_21 L8 L21 0.9500\nK_L8_22 L8 L22 0.9405\nK_L8_23 L8 L23 0.9310\nK_L8_24 L8 L24 0.9215\nK_L8_25 L8 L25 0.9120\nK_L8_26 L8 L26 0.9025\nK_L9_17 L9 L17 0.9061\nK_L9_18 L9 L18 0.9156\nK_L9_19 L9 L19 0.9251\nK_L9_20 L9 L20 0.9346\nK_L9_21 L9 L21 0.9441\nK_L9_22 L9 L22 0.9464\nK_L9_23 L9 L23 0.9369\nK_L9_24 L9 L24 0.9274\nK_L9_25 L9 L25 0.9179\nK_L9_26 L9 L26 0.9084\nK_L10_17 L10 L17 0.9001\nK_L10_18 L10 L18 0.9096\nK_L10_19 L10 L19 0.9191\nK_L10_20 L10 L20 0.9286\nK_L10_21 L10 L21 0.9381\nK_L10_22 L10 L22 0.9476\nK_L10_23 L10 L23 0.9429\nK_L10_24 L10 L24 0.9334\nK_L10_25 L10 L25 0.9239\nK_L10_26 L10 L26 0.9144\nK_L11_17 L11 L17 0.8942\nK_L11_18 L11 L18 0.9037\nK_L11_19 L11 L19 0.9132\nK_L11_20 L11 L20 0.9227\nK_L11_21 L11 L21 0.9322\nK_L11_22 L11 L22 0.9417\nK_L11_23 L11 L23 0.9488\nK_L11_24 L11 L24 0.9393\nK_L11_25 L11 L25 0.9298\nK_L11_26 L11 L26 0.9203\nK_L12_17 L12 L17 0.8882\nK_L12_18 L12 L18 0.8977\nK_L12_19 L12 L19 0.9072\nK_L12_20 L12 L20 0.9167\nK_L12_21 L12 L21 0.9262\nK_L12_22 L12 L22 0.9357\nK_L12_23 L12 L23 0.9452\nK_L12_24 L12 L24 0.9452\nK_L12_25 L12 L25 0.9357\nK_L12_26 L12 L26 0.9262\nK_L13_17 L13 L17 0.8823\nK_L13_18 L13 L18 0.8918\nK_L13_19 L13 L19 0.9013\nK_L13_20 L13 L20 0.9108\nK_L13_21 L13 L21 0.9203\nK_L13_22 L13 L22 0.9298\nK_L13_23 L13 L23 0.9393\nK_L13_24 L13 L24 0.9488\nK_L13_25 L13 L25 0.9417\nK_L13_26 L13 L26 0.9322\nK_L14_17 L14 L17 0.8764\nK_L14_18 L14 L18 0.8859\nK_L14_19 L14 L19 0.8954\nK_L14_20 L14 L20 0.9049\nK_L14_21 L14 L21 0.9144\nK_L14_22 L14 L22 0.9239\nK_L14_23 L14 L23 0.9334\nK_L14_24 L14 L24 0.9429\nK_L14_25 L14 L25 0.9476\nK_L14_26 L14 L26 0.9381\nK_L15_17 L15 L17 0.8704\nK_L15_18 L15 L18 0.8799\nK_L15_19 L15 L19 0.8894\nK_L15_20 L15 L20 0.8989\nK_L15_21 L15 L21 0.9084\nK_L15_22 L15 L22 0.9179\nK_L15_23 L15 L23 0.9274\nK_L15_24 L15 L24 0.9369\nK_L15_25 L15 L25 0.9464\nK_L15_26 L15 L26 0.9441\nK_L16_17 L16 L17 0.8645\nK_L16_18 L16 L18 0.8740\nK_L16_19 L16 L19 0.8835\nK_L16_20 L16 L20 0.8930\nK_L16_21 L16 L21 0.9025\nK_L16_22 L16 L22 0.9120\nK_L16_23 L16 L23 0.9215\nK_L16_24 L16 L24 0.9310\nK_L16_25 L16 L25 0.9405\nK_L16_26 L16 L26 0.9500
TEXT 3968 -504 Left 2 ;LV windings Coupling
TEXT 3968 2912 Left 2 ;HV Winding Coupling
TEXT 3968 4232 Left 2 ;Inter Winding Coupling

The netlist it stands for:
* lumped_network_Coupling_HV.asc
V1 N001 0 0 AC 1
C2 N015 N014 {n * CsL}
L2 N014 N015 {(M_air + L_L) / n}
CgL1 N015 0 {CgL / n}
C1 N014 N013 {n * CsL}
L1 N013 N014 {(M_air + L_L) / n}
CgL2 N014 0 {CgL / n}
C5 N017 N016 {n * CsL}
L4 N016 N017 {(M_air + L_L) / n}
CgL5 N017 0 {CgL / n}
C6 N016 N015 {n * CsL}
L3 N015 N016 {(M_air + L_L) / n}
CgL6 N016 0 {CgL / n}
C7 N019 N018 {n * CsL}
L6 N018 N019 {(M_air + L_L) / n}
CgL7 N019 0 {CgL / n}
C8 N018 N017 {n * CsL}
L5 N017 N018 {(M_air + L_L) / n}
CgL8 N018 0 {CgL / n}
C9 N021 N020 {n * CsL}
L8 N020 N021 {(M_air + L_L) / n}
CgL9 N021 0 {CgL / n}
C10 N020 N019 {n * CsL}
L7 N019 N020 {(M_air + L_L) / n}
CgL10 N020 0 {CgL / n}
C11 N012 N022 {n * CsL}
L10 N022 N012 {(M_air + L_L) / n}
CgL11 N012 0 {CgL / n}
C12 N022 N021 {n * CsL}
L9 N021 N022 {(M_air + L_L) / n}
CgL12 N022 0 {CgL / n}
C13 N024 N023 {n * CsL}
L12 N023 N024 {(M_air + L_L) / n}
CgL13 N024 0 {CgL / n}
C14 N023 N012 {n * CsL}
L11 N012 N023 {(M_air + L_L) / n}
CgL14 N023 0 {CgL / n}
C15 N026 N025 {n * CsL}
L14 N025 N026 {(M_air + L_L) / n}
CgL15 N026 0 {CgL / n}
C16 N025 N024 {n * CsL}
L13 N024 N025 {(M_air + L_L) / n}
CgL16 N025 0 {CgL / n}
C17 N028 N027 {n * CsL}
L16 N027 N028 {(M_air + L_L) / n}
CgL17 N028 0 {CgL / n}
C18 N027 N026 {n * CsL}
L15 N026 N027 {(M_air + L_L) / n}
CgL18 N027 0 {CgL / n}
C29 N002 N014 {CHL / nH}
C30 N003 N015 {CHL / nH}
C27 N010 N022 {CHL / nH}
C28 N011 N012 {CHL / nH}
C31 N004 N016 {CHL / nH}
C32 N005 N017 {CHL / nH}
C33 N006 N018 {CHL / nH}
C34 N007 N019 {CHL / nH}
C35 N008 N020 {CHL / nH}
C36 N009 N021 {CHL / nH}
R2 N011 0 {R}
C3 N001 N002 {nH * mc(CsH, Tol_Cs)}
L17 N002 N001 {(M_air +mc( L_H, Tol_LH )) / nH}
C4 N002 N003 {nH * mc(CsH, Tol_Cs)}
L18 N003 N002 {(M_air + mc(L_H, Tol_LH)) / nH}
CgL4 N002 0 {mc( CgH, Tol_Cg) / nH}
C19 N003 N004 {nH * mc(CsH, Tol_Cs)}
L19 N004 N003 {(M_air + mc(L_H, Tol_LH )) / nH}
CgL19 N003 0 {mc ( CgH, Tol_Cg) / nH}
C20 N004 N005 {nH * mc(CsH, Tol_Cs)}
L20 N005 N004 {(M_air + mc(L_H,Tol_LH)) / nH}
CgL20 N004 0 {mc(CgH, Tol_Cg) / nH}
C21 N005 N006 {nH * mc(CsH,Tol_Cs)}
L21 N006 N005 {(M_air + mc(L_H,Tol_LH)) / nH}
CgL21 N005 0 {mc(CgH, Tol_Cg) / nH}
C22 N006 N007 {nH * mc(CsH,Tol_Cs)}
L22 N007 N006 {(M_air + mc(L_H,Tol_LH)) / nH}
CgL22 N006 0 {mc( CgH, Tol_Cg) / nH}
C23 N007 N008 {nH * mc(CsH,Tol_Cs)}
L23 N008 N007 {(M_air + mc(L_H,Tol_LH)) / nH}
CgL23 N007 0 { mc( CgH, Tol_Cg) / nH}
C24 N008 N009 {nH * mc(CsH,Tol_Cs)}
L24 N009 N008 {(M_air + mc(L_H,Tol_LH)) / nH}
CgL24 N008 0 { mc( CgH, Tol_Cg) / nH}
C25 N009 N010 {nH * mc(CsH,Tol_Cs)}
L25 N010 N009 {(M_air + mc(L_H,Tol_LH)) / nH}
CgL25 N009 0 {mc ( CgH, Tol_Cg) / nH}
C26 N010 N011 {nH * mc(CsH,Tol_Cs)}
L26 N011 N010 {(M_air + mc(L_H,Tol_LH)) / nH}
CgL26 N010 0 {mc ( CgH, Tol_Cg) / nH}
CgL3 N013 0 {CgL / n}
.ac dec 50 1 1e6
.param R=50
.param CsL 5.67e-12
.param n=16
.param L_L 0.00158 + 0.72
.param M_air=14.75e-3
.param CgL 5.64e-9
.param CsH 401.14e-12
.param CgH 482.15e-12
.param L_H=637.62e-3 + 90.03
.param CHL 453.58e-12
.param nH  10
* HV Parameters
* C_HL: Assumed Even Distribution
* LV Parameters
.param Tol_Cg=0.02
.param Tol_LH=0.02
.param Tol_Cs=0.02
K_L1_2 L1 L2 0.9878
K_L1_3 L1 L3 0.9786
K_L1_4 L1 L4 0.9694
K_L1_5 L1 L5 0.9603
K_L1_6 L1 L6 0.9511
K_L1_7 L1 L7 0.9419
K_L1_8 L1 L8 0.9327
K_L1_9 L1 L9 0.9235
K_L1_10 L1 L10 0.9143
K_L1_11 L1 L11 0.9051
K_L1_12 L1 L12 0.8959
K_L1_13 L1 L13 0.8867
K_L1_14 L1 L14 0.8776
K_L1_15 L1 L15 0.8684
K_L1_16 L1 L16 0.8592
K_L2_3 L2 L3 0.9878
K_L2_4 L2 L4 0.9786
K_L2_5 L2 L5 0.9694
K_L2_6 L2 L6 0.9603
K_L2_7 L2 L7 0.9511
K_L2_8 L2 L8 0.9419
K_L2_9 L2 L9 0.9327
K_L2_10 L2 L10 0.9235
K_L2_11 L2 L11 0.9143
K_L2_12 L2 L12 0.9051
K_L2_13 L2 L13 0.8959
K_L2_14 L2 L14 0.8867
K_L2_15 L2 L15 0.8776
K_L2_16 L2 L16 0.8684
K_L3_4 L3 L4 0.9878
K_L3_5 L3 L5 0.9786
K_L3_6 L3 L6 0.9694
K_L3_7 L3 L7 0.9603
K_L3_8 L3 L8 0.9511
K_L3_9 L3 L9 0.9419
K_L3_10 L3 L10 0.9327
K_L3_11 L3 L11 0.9235
K_L3_12 L3 L12 0.9143
K_L3_13 L3 L13 0.9051
K_L3_14 L3 L14 0.8959
K_L3_15 L3 L15 0.8867
K_L3_16 L3 L16 0.8776
K_L4_5 L4 L5 0.9878
K_L4_6 L4 L6 0.9786
K_L4_7 L4 L7 0.9694
K_L4_8 L4 L8 0.9603
K_L4_9 L4 L9 0.9511
K_L4_10 L4 L10 0.9419
K_L4_11 L4 L11 0.9327
K_L4_12 L4 L12 0.9235
K_L4_13 L4 L13 0.9143
K_L4_14 L4 L14 0.9051
K_L4_15 L4 L15 0.8959
K_L4_16 L4 L16 0.8867
K_L5_6 L5 L6 0.9878
K_L5_7 L5 L7 0.9786
K_L5_8 L5 L8 0.9694
K_L5_9 L5 L9 0.9603
K_L5_10 L5 L10 0.9511
K_L5_11 L5 L11 0.9419
K_L5_12 L5 L12 0.9327
K_L5_13 L5 L13 0.9235
K_L5_14 L5 L14 0.9143
K_L5_15 L5 L15 0.9051
K_L5_16 L5 L16 0.8959
K_L6_7 L6 L7 0.9878
K_L6_8 L6 L8 0.9786
K_L6_9 L6 L9 0.9694
K_L6_10 L6 L10 0.9603
K_L6_11 L6 L11 0.9511
K_L6_12 L6 L12 0.9419
K_L6_13 L6 L13 0.9327
K_L6_14 L6 L14 0.9235
K_L6_15 L6 L15 0.9143
K_L6_16 L6 L16 0.9051
K_L7_8 L7 L8 0.9878
K_L7_9 L7 L9 0.9786
K_L7_10 L7 L10 0.9694
K_L7_11 L7 L11 0.9603
K_L7_12 L7 L12 0.9511
K_L7_13 L7 L13 0.9419
K_L7_14 L7 L14 0.9327
K_L7_15 L7 L15 0.9235
K_L7_16 L7 L16 0.9143
K_L8_9 L8 L9 0.9878
K_L8_10 L8 L10 0.9786
K_L8_11 L8 L11 0.9694
K_L8_12 L8 L12 0.9603
K_L8_13 L8 L13 0.9511
K_L8_14 L8 L14 0.9419
K_L8_15 L8 L15 0.9327
K_L8_16 L8 L16 0.9235
K_L9_10 L9 L10 0.9878
K_L9_11 L9 L11 0.9786
K_L9_12 L9 L12 0.9694
K_L9_13 L9 L13 0.9603
K_L9_14 L9 L14 0.9511
K_L9_15 L9 L15 0.9419
K_L9_16 L9 L16 0.9327
K_L10_11 L10 L11 0.9878
K_L10_12 L10 L12 0.9786
K_L10_13 L10 L13 0.9694
K_L10_14 L10 L14 0.9603
K_L10_15 L10 L15 0.9511
K_L10_16 L10 L16 0.9419
K_L11_12 L11 L12 0.9878
K_L11_13 L11 L13 0.9786
K_L11_14 L11 L14 0.9694
K_L11_15 L11 L15 0.9603
K_L11_16 L11 L16 0.9511
K_L12_13 L12 L13 0.9878
K_L12_14 L12 L14 0.9786
K_L12_15 L12 L15 0.9694
K_L12_16 L12 L16 0.9603
K_L13_14 L13 L14 0.9878
K_L13_15 L13 L15 0.9786
K_L13_16 L13 L16 0.9694
K_L14_15 L14 L15 0.9878
K_L14_16 L14 L16 0.9786
K_L15_16 L15 L16 0.9878
K_L17_18 L17 L18 0.9823
K_L17_19 L17 L19 0.9676
K_L17_20 L17 L20 0.9529
K_L17_21 L17 L21 0.9382
K_L17_22 L17 L22 0.9235
K_L17_23 L17 L23 0.9088
K_L17_24 L17 L24 0.8941
K_L17_25 L17 L25 0.8794
K_L17_26 L17 L26 0.8647
K_L18_19 L18 L19 0.9823
K_L18_20 L18 L20 0.9676
K_L18_21 L18 L21 0.9529
K_L18_22 L18 L22 0.9382
K_L18_23 L18 L23 0.9235
K_L18_24 L18 L24 0.9088
K_L18_25 L18 L25 0.8941
K_L18_26 L18 L26 0.8794
K_L19_20 L19 L20 0.9823
K_L19_21 L19 L21 0.9676
K_L19_22 L19 L22 0.9529
K_L19_23 L19 L23 0.9382
K_L19_24 L19 L24 0.9235
K_L19_25 L19 L25 0.9088
K_L19_26 L19 L26 0.8941
K_L20_21 L20 L21 0.9823
K_L20_22 L20 L22 0.9676
K_L20_23 L20 L23 0.9529
K_L20_24 L20 L24 0.9382
K_L20_25 L20 L25 0.9235
K_L20_26 L20 L26 0.9088
K_L21_22 L21 L22 0.9823
K_L21_23 L21 L23 0.9676
K_L21_24 L21 L24 0.9529
K_L21_25 L21 L25 0.9382
K_L21_26 L21 L26 0.9235
K_L22_23 L22 L23 0.9823
K_L22_24 L22 L24 0.9676
K_L22_25 L22 L25 0.9529
K_L22_26 L22 L26 0.9382
K_L23_24 L23 L24 0.9823
K_L23_25 L23 L25 0.9676
K_L23_26 L23 L26 0.9529
K_L24_25 L24 L25 0.9823
K_L24_26 L24 L26 0.9676
K_L25_26 L25 L26 0.9823
K_L1_17 L1 L17 0.9464
K_L1_18 L1 L18 0.9369
K_L1_19 L1 L19 0.9274
K_L1_20 L1 L20 0.9179
K_L1_21 L1 L21 0.9084
K_L1_22 L1 L22 0.8989
K_L1_23 L1 L23 0.8894
K_L1_24 L1 L24 0.8799
K_L1_25 L1 L25 0.8704
K_L1_26 L1 L26 0.8609
K_L2_17 L2 L17 0.9476
K_L2_18 L2 L18 0.9429
K_L2_19 L2 L19 0.9334
K_L2_20 L2 L20 0.9239
K_L2_21 L2 L21 0.9144
K_L2_22 L2 L22 0.9049
K_L2_23 L2 L23 0.8954
K_L2_24 L2 L24 0.8859
K_L2_25 L2 L25 0.8764
K_L2_26 L2 L26 0.8669
K_L3_17 L3 L17 0.9417
K_L3_18 L3 L18 0.9488
K_L3_19 L3 L19 0.9393
K_L3_20 L3 L20 0.9298
K_L3_21 L3 L21 0.9203
K_L3_22 L3 L22 0.9108
K_L3_23 L3 L23 0.9013
K_L3_24 L3 L24 0.8918
K_L3_25 L3 L25 0.8823
K_L3_26 L3 L26 0.8728
K_L4_17 L4 L17 0.9357
K_L4_18 L4 L18 0.9452
K_L4_19 L4 L19 0.9452
K_L4_20 L4 L20 0.9357
K_L4_21 L4 L21 0.9262
K_L4_22 L4 L22 0.9167
K_L4_23 L4 L23 0.9072
K_L4_24 L4 L24 0.8977
K_L4_25 L4 L25 0.8882
K_L4_26 L4 L26 0.8788
K_L5_17 L5 L17 0.9298
K_L5_18 L5 L18 0.9393
K_L5_19 L5 L19 0.9488
K_L5_20 L5 L20 0.9417
K_L5_21 L5 L21 0.9322
K_L5_22 L5 L22 0.9227
K_L5_23 L5 L23 0.9132
K_L5_24 L5 L24 0.9037
K_L5_25 L5 L25 0.8942
K_L5_26 L5 L26 0.8847
K_L6_17 L6 L17 0.9239
K_L6_18 L6 L18 0.9334
K_L6_19 L6 L19 0.9429
K_L6_20 L6 L20 0.9476
K_L6_21 L6 L21 0.9381
K_L6_22 L6 L22 0.9286
K_L6_23 L6 L23 0.9191
K_L6_24 L6 L24 0.9096
K_L6_25 L6 L25 0.9001
K_L6_26 L6 L26 0.8906
K_L7_17 L7 L17 0.9179
K_L7_18 L7 L18 0.9274
K_L7_19 L7 L19 0.9369
K_L7_20 L7 L20 0.9464
K_L7_21 L7 L21 0.9441
K_L7_22 L7 L22 0.9346
K_L7_23 L7 L23 0.9251
K_L7_24 L7 L24 0.9156
K_L7_25 L7 L25 0.9061
K_L7_26 L7 L26 0.8966
K_L8_17 L8 L17 0.9120
K_L8_18 L8 L18 0.9215
K_L8_19 L8 L19 0.9310
K_L8_20 L8 L20 0.9405
K_L8_21 L8 L21 0.9500
K_L8_22 L8 L22 0.9405
K_L8_23 L8 L23 0.9310
K_L8_24 L8 L24 0.9215
K_L8_25 L8 L25 0.9120
K_L8_26 L8 L26 0.9025
K_L9_17 L9 L17 0.9061
K_L9_18 L9 L18 0.9156
K_L9_19 L9 L19 0.9251
K_L9_20 L9 L20 0.9346
K_L9_21 L9 L21 0.9441
K_L9_22 L9 L22 0.9464
K_L9_23 L9 L23 0.9369
K_L9_24 L9 L24 0.9274
K_L9_25 L9 L25 0.9179
K_L9_26 L9 L26 0.9084
K_L10_17 L10 L17 0.9001
K_L10_18 L10 L18 0.9096
K_L10_19 L10 L19 0.9191
K_L10_20 L10 L20 0.9286
K_L10_21 L10 L21 0.9381
K_L10_22 L10 L22 0.9476
K_L10_23 L10 L23 0.9429
K_L10_24 L10 L24 0.9334
K_L10_25 L10 L25 0.9239
K_L10_26 L10 L26 0.9144
K_L11_17 L11 L17 0.8942
K_L11_18 L11 L18 0.9037
K_L11_19 L11 L19 0.9132
K_L11_20 L11 L20 0.9227
K_L11_21 L11 L21 0.9322
K_L11_22 L11 L22 0.9417
K_L11_23 L11 L23 0.9488
K_L11_24 L11 L24 0.9393
K_L11_25 L11 L25 0.9298
K_L11_26 L11 L26 0.9203
K_L12_17 L12 L17 0.8882
K_L12_18 L12 L18 0.8977
K_L12_19 L12 L19 0.9072
K_L12_20 L12 L20 0.9167
K_L12_21 L12 L21 0.9262
K_L12_22 L12 L22 0.9357
K_L12_23 L12 L23 0.9452
K_L12_24 L12 L24 0.9452
K_L12_25 L12 L25 0.9357
K_L12_26 L12 L26 0.9262
K_L13_17 L13 L17 0.8823
K_L13_18 L13 L18 0.8918
K_L13_19 L13 L19 0.9013
K_L13_20 L13 L20 0.9108
K_L13_21 L13 L21 0.9203
K_L13_22 L13 L22 0.9298
K_L13_23 L13 L23 0.9393
K_L13_24 L13 L24 0.9488
K_L13_25 L13 L25 0.9417
K_L13_26 L13 L26 0.9322
K_L14_17 L14 L17 0.8764
K_L14_18 L14 L18 0.8859
K_L14_19 L14 L19 0.8954
K_L14_20 L14 L20 0.9049
K_L14_21 L14 L21 0.9144
K_L14_22 L14 L22 0.9239
K_L14_23 L14 L23 0.9334
K_L14_24 L14 L24 0.9429
K_L14_25 L14 L25 0.9476
K_L14_26 L14 L26 0.9381
K_L15_17 L15 L17 0.8704
K_L15_18 L15 L18 0.8799
K_L15_19 L15 L19 0.8894
K_L15_20 L15 L20 0.8989
K_L15_21 L15 L21 0.9084
K_L15_22 L15 L22 0.9179
K_L15_23 L15 L23 0.9274
K_L15_24 L15 L24 0.9369
K_L15_25 L15 L25 0.9464
K_L15_26 L15 L26 0.9441
K_L16_17 L16 L17 0.8645
K_L16_18 L16 L18 0.8740
K_L16_19 L16 L19 0.8835
K_L16_20 L16 L20 0.8930
K_L16_21 L16 L21 0.9025
K_L16_22 L16 L22 0.9120
K_L16_23 L16 L23 0.9215
K_L16_24 L16 L24 0.9310
K_L16_25 L16 L25 0.9405
K_L16_26 L16 L26 0.9500
* LV windings Coupling
* HV Winding Coupling
* Inter Winding Coupling
.backanno
.end